# Altium schematic sheet RS232_CAN_DAC.SchDoc
size Letter; SheetNumber: 3; SheetTotal: 5
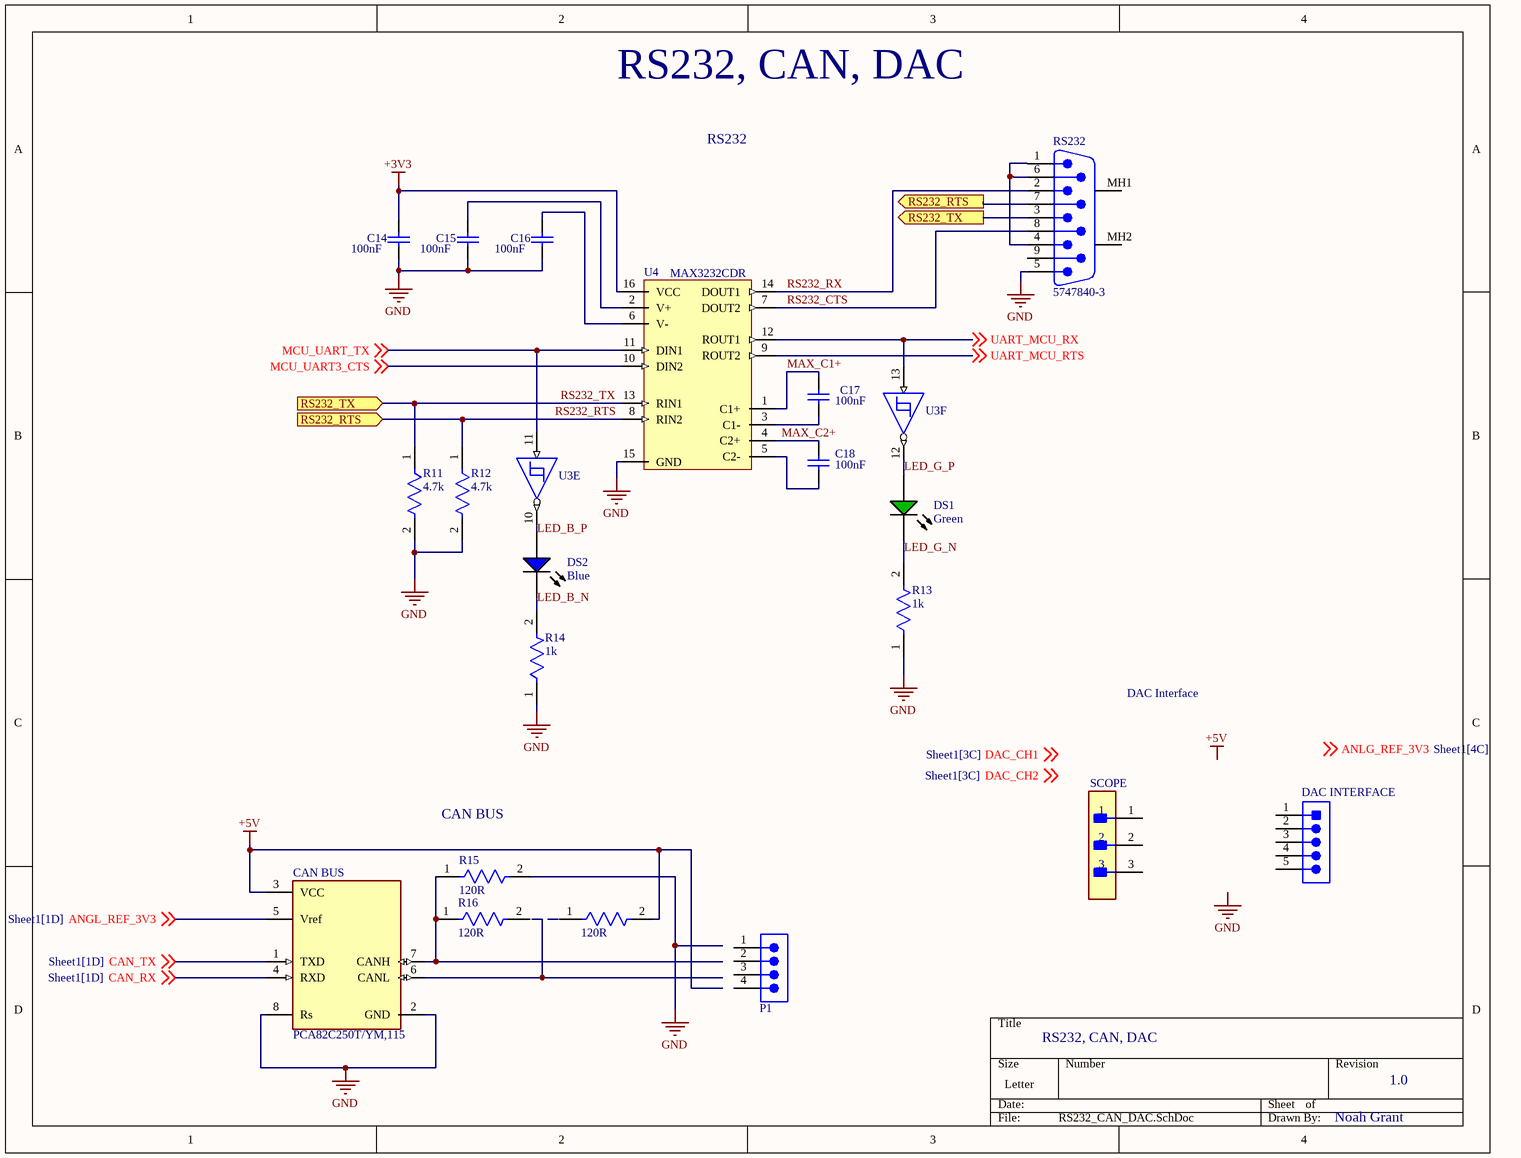
[diagram p0: RS232_CAN_DAC.SchDoc]

## Parts
?  120R  [FP-CRCW0603-e3-MFG]
C14  100nF  [CAPC0805(2012)100_M]
C15  100nF  [CAPC0805(2012)100_M]
C16  100nF  [CAPC0805(2012)100_M]
C17  100nF  [CAPC0805(2012)100_M]
C18  100nF  [CAPC0805(2012)100_M]
CAN_BUS  PCA82C250T/YM,115  [FP-PCA82C250T-YM_115-MFG]
DAC_INTERFACE  640456-5  [TECO-640456-5]  (value not drawn)
DS1  Green  [AVAG-HSMX-C190_V]
DS2  Blue  [AVAG-HSMX-C190_V]
P1  TSW-104-08-L-S  [SMTC-TSW-104-08-X-S]  (value not drawn)
R11  4.7k  [FP-CRCW0603-e3-IPC_A]
R12  4.7k  [FP-CRCW0603-e3-IPC_A]
R13  1k  [FP-CRCW0603-e3-MFG]
R14  1k  [FP-CRCW0603-e3-MFG]
R15  120R  [FP-CRCW0603-e3-MFG]
R16  120R  [FP-CRCW0603-e3-MFG]
RS232  5747840-3  [TECO-5747840-3_V]
SCOPE  22-29-2031  [FP-22-29-2031-MFG]  (value not drawn)
U3  SN74HC14PWT  [PW0014A_M]  (value not drawn)  (parts E,F of 7)
U4  MAX3232CDR  [D0016A_L]

## Ports
RS232_RTS (in, see RS232_CAN_DAC[3A], Sheet1[1B], Sheet1[3A]), RS232_RTS (out, see RS232_CAN_DAC[1B], Sheet1[1B], Sheet1[3A]), RS232_TX (in, see RS232_CAN_DAC[3A], Sheet1[1B], Sheet1[3A]), RS232_TX (out, see RS232_CAN_DAC[1B], Sheet1[1B], Sheet1[3A])

## Nets
+3V3: C14.2 U4.16(VCC)
+5V: ?.2 CAN_BUS.3(VCC)
GND: C14.1 C15.1 C16.1 CAN_BUS.2(GND) CAN_BUS.8(Rs) R11.2 R12.2 R13.1 R14.1 R15.2 RS232.5 U4.15(GND)
ANGL_REF_3V3: CAN_BUS.5(Vref) ; off-sheet ANGL_REF_3V3
CAN_RX: CAN_BUS.4(RXD) ; off-sheet CAN_RX
CAN_TX: CAN_BUS.1(TXD) ; off-sheet CAN_TX
LED_B_N: DS2.2(K) R14.2
LED_G_N: DS1.2(K) R13.2
LED_G_P: DS1.1(A) U3.12(~{6Y})
MAX_C1+: C17.2 U4.1(C1+)
MAX_C2+: C18.2 U4.4(C2+)
MCU_UART3_CTS: U4.10(DIN2) ; off-sheet MCU_UART3_CTS
MCU_UART_TX: U3.11(5A) U4.11(DIN1) ; off-sheet MCU_UART_TX
RS232_CTS: RS232.8 U4.7(DOUT2)
RS232_RTS: R12.1 RS232.7 U4.8(RIN2) ; port RS232_RTS
RS232_RX: RS232.2 U4.14(DOUT1)
RS232_TX: R11.1 RS232.3 U4.13(RIN1) ; port RS232_TX
UART_MCU_RTS: U4.9(ROUT2) ; off-sheet UART_MCU_RTS
UART_MCU_RX: U3.13(6A) U4.12(ROUT1) ; off-sheet UART_MCU_RX
NetC15_2: C15.2 U4.2(V+)
NetC16_2: C16.2 U4.6(V-)
NetC17_1: C17.1 U4.3(C1-)
NetC18_1: C18.1 U4.5(C2-)
NetCAN_BUS_7: CAN_BUS.7(CANH) R15.1 R16.1
NetDS2_1: DS2.1(A) U3.10(~{5Y})
NetRS232_1: RS232.1 RS232.4 RS232.6

Not connected (* = marked no-connect by the designer): ? 1; CAN_BUS 6(CANL); DAC_INTERFACE 1(DTR) 2(RXI) 3(TXO) 4(VCC) 5(CTS); P1 1 2 3 4; R16 2; RS232 9 MH1 MH2; SCOPE 1 2 3

## Notes on the sheet
- RS232, CAN, DAC
- RS232
- DAC Interface
- CAN BUS
- 1.0
- Noah Grant
- Labels drawn without touching a wire or pin: +5V, ANLG_REF_3V3, DAC_CH1, DAC_CH2, GND, LED_B_P

## Library data of the parts
? R15 R16 = CMP-1666-00020-3: RES Thick Film, 120Ω, 1%, 0.1W, 100ppm/°C, 0603; Power Rating: 100mW; Working Voltage: 75V; RoHS Compliant: Yes; Lead Free: Lead Free; Termination: SMD/SMT; Radiation Hardening: No; Case Code (Imperial): 0603; Series: CRCW; Resistance Tolerance: 1%; Number of Terminations: 2; Tolerance: 1%; Max Operating Temperature: 155°C; Contact Plating: Tin; Package Quantity: 10; Max Power Dissipation: 100mW; Case Code (Metric): 1608; Weight: 7.1E-05oz; Packaging: Tape and Reel; Mount: Surface Mount; Military Standard: Not; Construction: Rectangular; Resistance: 120R; Features: Automotive AEC-Q200; Depth: 0.85mm; Min Operating Temperature: -55°C; Case/Package: 0603; Height: 0.45mm; Voltage Rating (DC): 75V; Width: 0.033inch; Technology: THICK FILM; Length: 1.55mm; Voltage Rating: 75V; Temperature Coefficient: 100ppm/°C; Resistor Type: Thick Film
C14-C18 = CMP-1036-04393-1: CAP 100nF 10V ±5% 0805 (2012 Metric) Thickness 1mm SMD; Tolerance: Â±5%; Case-EIA: 0805; Case-Metric: 2012; Rated Voltage: 10 V; Technology: SMT; Value: 100nF; Max Thickness: 1 mm
CAN_BUS = CMP-10098-000006-1: IC TRANSCEIVER HALF 1/1 8SO; Manufacturer: NXP Semiconductors; Interface: CAN; Min Supply Voltage: 4.5V; Nominal Supply Current: 14-70mA; Max Supply Voltage: 5.5V; Standoff Height: 0.1mm; Max Junction Temp: +150°C; ComponentLink2URL: https://www.nxp.com/docs/en/data-sheet/PCA82C250.pdf; Temperature Range High: +150°C; Mouser Description: CAN Interface IC CAN CONTROLLER INTERFACE; Ipc Land Pattern Name: SOIC127P600X175-8; Device Class L3: unset; Octopart: https://octopart.com/pca82c250t%2Fym%2C115-nxp+semiconductors-18837169; Lead Free: Yes; ComponentLink2Description: Datasheet; Device Class L1: Integrated Circuits (ICs); Ambient Temperature Range High: +125°C; Package: SOIC8; Digikey Description: IC TRANSCEIVER HALF 1/1 8SO; RoHS: TRUE; Automotive: No; Temperature Range Low: -40°C; Manufacturer Part Number: PCA82C250T/YM,115; Device Class L2: Interface ICs; Ambient Temperature Range Low: -40°C; Temperature: -40°C to +150°C; Category: IC; Footprint Url: https://www.nxp.com/docs/en/package-information/SOT96-1.pdf; Height: 1.75mm
DAC_INTERFACE = CMP-1684-00014-1: Male Header, Pitch 2.54 mm, 1 x 5 Position, Height 10.03 mm, Tail Length 3.56 mm, / -55 to 105 degC, RoHS, Bulk; Manufacturer: TE Connectivity; Material, Housing: Polyester; Brand/Series: MTA-100Series; Color, Housing: White; Current, Rating: 5 / A; Temperature, Operating: -55to+105 / °C; Connector Type: MTA-100; Agency Approvals: CSA,UL; Material, Contact: CopperAlloy; Mounting Hole Size: 0.04 / "; Voltage, Rating: 250 / V; Contact Termination Area Plating: Tin; Pin Spacing: 0.1 / "; Primary Type: InterconnectSystem; Special Features: Pinstrip; Mount Angle: Vertical; Contact Centerline Spacing: 0.100 / in.; Number of Contacts: 5; Standards: RoHSCompliant,ELVCompliant,UL94V-0; Angle: Straight; Length, Terminal Post: 0.14 / in.; Manufacturer URL: http://www.te.com; Flammability Rating: UL94V-0; Mounting Type: PCMount; Termination: Solder; Package Reference: THD; Length, Overall: 0.5 / "; Contact Mating Area Plating: Tin; Length, Pin: 0.14 / "; Datasheet URL: http://sigma.octopart.com/77881742/technical_drawing/TE-Connectivity-640456-5.pdf; Package Description: Male Header, Pitch 2.54 mm, 1 x 5 Position, Height 10.03 mm, Tail Length 3.56 mm; Datasheet Version: Rev. W3; Contact Plating: Tin; Color: White; Number of Positions: 5; Type: PCBPlug; Contact Shape: Square; Number of Rows: 1; Size, Post: 0.025 / in.
DS1 = CMP-1744-00002-1: Chip LED, Green, 2.2 V, -40 to 85 degC, 2-Pin SMD, RoHS, Tape and Reel; Frequency: 400 KHz; Max Supply Voltage: 5.5 V; Access Time: 3500 ns; Clock Frequency: 100 KHz; Case\Package: SOIC; Density: 32 kb; Nominal Supply Current: 2 mA; Interface: Serial; Min Supply Voltage: 1.7 V; Packaging: Tape and Reel; PackageReference: HSMX-C190; ComponentLink2URL: http://docs.avagotech.com/docs/AV02-0551EN; RoHSCompliant: true; Pins: 8; REACH SVHC: No SVHC; Max Operating Temperature: 85 degC; Width: 4 mm; Radiation Hardening: No; Package Quantity: 3000; ComponentLink3Description: Package Specification; ComponentLink1Description: Manufacturer URL; Min Operating Temperature: -40 degC; PackageDescription: 2-Pin Surface Mount Device, Body 1.6 x 0.8 mm, Height 0.9 mm; Max Clock Frequency: 100 KHz; Height: 1.5 mm; ComponentLink1URL: http://www.avagotech.com/; DatasheetVersion: Mar-12; ComponentLink2Description: Datasheet; Mount: Surface Mount; Length: 5 mm; ComponentLink3URL: http://www.fairchildsemi.com/dwg/MA/MA03D.pdf
DS2 = CMP-1744-00007-1: LED Uni-Color Blue, 78 mW, 20 mA, -40 to 85 degC, 2-Pin SMD, RoHS, Tape and Reel; Rds On Max: 10 Ohm; Nominal Vgs: -1.7 V; Max Power Dissipation: 360 mW; Elements: 1; Case\Package: TO-236-3; Input Capacitance: 73 pF; Typical Rise Time: 6.3 ns; Nominal Dual Supply Voltage: -50 V; Packaging: Tape and Reel; Height: 0.93 mm; Mount: Surface Mount; RoHSCompliant: true; DatasheetVersion: Apr-10; REACH SVHC: No SVHC; ComponentLink1URL: http://www.avagotech.com/; Radiation Hardening: No; ComponentLink3Description: Package Specification; ComponentLink3URL: http://www.fairchildsemi.com/dwg/MA/MA03D.pdf; ComponentLink2Description: Datasheet; PackageDescription: 2-Pin Surface Mount Device, Body 1.6 x 0.8 mm, Height 0.9 mm; Package Quantity: 3000; PackageReference: HSMX-C190; ComponentLink1Description: Manufacturer URL; Pins: 3; Length: 2.92 mm; ComponentLink2URL: http://docs.avagotech.com/docs/AV02-0977EN; Min Operating Temperature: -55 degC; Width: 1.3 mm; Max Operating Temperature: 150 degC
P1 = CMP-1024-00358-1: 0.025" SQ Post Header, Through-hole, Vertical, -55 to 125 degC, 2.54 mm Pitch, 4-Pin, Male, RoHS; Manufacturer: Samtec; Pitch: 2.54 mm; PartNumber: TSW-104-08-L-S; RoHS: True; Temperature Range: -55 to 125 degC; PackageDescription: .025[0.64] SQ. Post Terminal Strip Assembly; Orientation: Vertical; ComponentLink2URL: http://www.samtec.com/documents/webfiles/pdf/TSW_TH.PDF; ComponentLink1Description: Manufacturer URL; ComponentLink2Description: Datasheet; PackageVersion: DM, 8/1988; ComponentLink3URL: http://www.samtec.com/documents/webfiles/cpdf/TSW-XXX-XX-XXX-X-XX-XXX-MKT.pdf; Mounting Technology: Through-hole; PackageReference: TSW-104-08-X-S; ComponentLink3Description: Package Specification; ComponentLink1URL: http://www.samtec.com; DatasheetVersion: F-214
R11 R12 = CMP-1666-00019-3: RES Thick Film, 4.7kΩ, 1%, 0.1W, 100ppm/°C, 0603; Resistance: 4.7kR; Voltage Rating: 75V; Power Rating: 100mW; Case Code (Metric): 1608; Military Standard: Not; Packaging: Tape and Reel; Termination: SMD/SMT; Temperature Coefficient: 100ppm/°C; Lead Free: Lead Free; Length: 1.55mm; Width: 0.85mm; Height: 0.45mm; Depth: 0.85mm; Weight: 7.1E-05oz; Case Code (Imperial): 0603; Contact Plating: Tin; Case/Package: 0603; Max Operating Temperature: 155°C; Mount: Surface Mount; Tolerance: 1%; Min Operating Temperature: -55°C; Package Quantity: 5000; Voltage Rating (DC): 75V; Composition: Thick Film
R13 R14 = CMP-1666-00003-5: RES Thick Film, 1kΩ, 1%, 0.1W, 100ppm/°C, 0603; Max Power Dissipation: 100mW; Voltage Rating: 75V; Resistance: 1kR; Max Operating Temperature: 155°C; Number of Pins: 2; Case Code (Imperial): 0603; Width: 0.033inch; Power Rating: 100mW; Number of Terminations: 2; Package Quantity: 10; Weight: 7.1E-05oz; Tolerance: 1%; Temperature Coefficient: 100ppm/°C; Military Standard: Not; Mount: Surface Mount; Voltage Rating (DC): 75V; Depth: 0.85mm; Composition: Thick Film; Radiation Hardening: No; Termination: SMD/SMT; Length: 1.55mm; Case Code (Metric): 1608; Contact Plating: Tin; Min Operating Temperature: -55°C; Packaging: Tape and Reel; Height: 0.45mm; Lead Free: Lead Free; Case/Package: 0603; Features: Automotive AEC-Q200
RS232 = CMP-2000-05647-1: Male D-Sub Connector, Pitch 2.74 mm, 2 Row, 9 Position, Height 12.93 mm, Tail Length 3.17 mm, -55 to 105 degC, RoHS, Tray; Manufacturer: TE Connectivity; Current Rating: 6A; Flange Feature: Housing/Shell(4-40); Catalog Drawings: AMPD-SubMale.318; Dynamic Catalog: AMPLIMITEHD-20Series; Number of Positions: 9; Voltage Rating: 125V; Other Names: A32091; Mating Products: 5-747905-7-ND / -CONND-SUBRCPT9POSVERTSLD / 5-787355-1-ND / -CONNRCPT9POSVERTSOLDERCUP / 5746861-4-ND / -CONNRECEPT9POSGOLDIDC / A32510-ND / -CONND-SUBRCPT9POSSLDCUPAU / AFL09B-ND / -CONND-SUBRECEPT9POS30GOLD / A31975-ND / -CONND-SUBRECEPT9P22-26AWGAU / A31974-ND / -CONND-SUBRECEPT9P20-22AWGAU / A31973-ND / -CONND-SUBRECEPT9P26-30AWGAU / A31931-ND / -CONND-SUBRCPT9POS22-26AWGAU; 3D Model: 5747840-3.pdf; Connector Type: Plug,MalePins; Product Training Modules: AMPLIMITED-SubConnectors; Featured Product: AMPLIMITED-SubminiatureConnectors; Contact Finish Thickness: Flash; Operating Temperature: -55°C~105°C; Shell Material, Finish: Steel,TinPlated; Datasheet URL: http://www.te.com/commerce/DocumentDelivery/DDEController?Action=srchrtrv&DocNm=5747840&DocType=Customer+Drawing&DocLang=English; Shell Size, Connector Layout: 1(DE,E); Package Description: Male D-Sub Connector, Pitch 2.74 mm, 2 Row, 9 Position, Height 12.93 mm, Tail Length 3.17 mm; Package Reference: 5747840-3; Mounting Technology: ThroughHole; Contact Type: Signal; Standard Package: 130; Family: D-SubConnectors; Manufacturer URL: http://www.te.com/; Contact Finish: Gold; Category: Connectors,Interconnects; RoHS Information: 5747840-3StatementofCompliance; Color: Black; Number of Rows: 2; Connector Style: D-Sub; Series: AMPLIMITEHD-20; Mounting Type: ThroughHole,RightAngle; Features: BoardLock,GroundStrap,GroundingIndents; Datasheet Version: Rev. D, 01/2013; Termination: Solder
SCOPE = CMP-04776-000327-1: CONN HEADER VERT 3POS 2.54MM; Contact Resistance: 10mR; Number of Positions: 3; Voltage Rating: 250V; Gender: Male; Connector Type: Male Pin; Current Rating: 4A; Packaging: Bulk; Housing Material: Nylon; Min Operating Temperature: 0°C; Color: Natural; RoHS Compliant: Yes; Housing Color: White; Number of Rows: 1; Pitch: 2.54mm; Mount: Through Hole; Fastening Type: Friction; Length: 7.62mm; Depth: 5.8mm; Contact Material: Brass; Max Operating Temperature: 75°C; Number of Contacts: 3; Contact Type: Male Pin; Working Voltage: 250V; Orientation: Straight; Lead Pitch: 2.54mm; Radiation Hardening: No; Termination: Solder; Contact Plating: Gold; Contact Mating Length: 0.295inch; Series: KK® 6410
U3 = CMP-1615-00108-4: Hex Schmitt-Trigger Inverters, PW0014A, SMALL T&R; Manufacturer: Texas Instruments; F @ Nom Voltage(Max)(Mhz): 20; Input Type: CMOS; VCC(Min)(V): 2; Bits(#): 6; Output Drive (IOL/IOH)(Max)(mA): -4/4; Technology Family: HC; Rating: Catalog; Voltage(Nom)(V): 5; ICC @ Nom Voltage(Max)(mA): 0.02; Schmitt Trigger: Yes; tpd @ Nom Voltage(Max)(ns): 31; Operating Temperature Range(C): -40 to 85; Output Type: CMOS; DatasheetVersion: SCLS085G; Generic Part Number: SN74HC14; VCC(Max)(V): 6; Code_JEDEC: MO-153; PackageReference: PW0014A
U4 = CMP-0299-00399-2: 3-V to 5.5-V Multichannel RS-232 Line Driver / Receiver with ±15-kV ESD Protection, 0 to 70 degC, 16-Pin SOIC (D), Green (RoHS & no Sb/Br); Receivers Per Package: 2; ESD HBM(kV): +/-15; ICC(Max)(mA): 1; Supply Voltage(s)(V): 3.3 or 5.0; Single Supply: TRUE; ComponentLink1URL: www.ti.com; ComponentLink3URL: http://www.ti.com/litv/pdf/mpds178g; PackageReference: D0016A; ComponentLink2Description: Datasheet; ComponentLink2URL: http://www.ti.com/general/docs/lit/getliterature.tsp?genericPartNumber=MAX3232&fileType=pdf; ComponentLink1Description: Manufacturer URL; PackageDescription: 16-Pin Plastic Small Outline Integrated Circuit, 9.9 x 3.9 mm, Pitch 1.27 mm Pitch; PackageVersion: revM, Jun-2011; Drivers Per Package: 2; SubFamily: RS-232; DatasheetVersion: SLLS410I; ComponentLink3Description: Package Specification; RS-232: TRUE